# Altium schematic sheet 24 AUDIO CMEDIA.SchDoc
size 594 x 420 mm
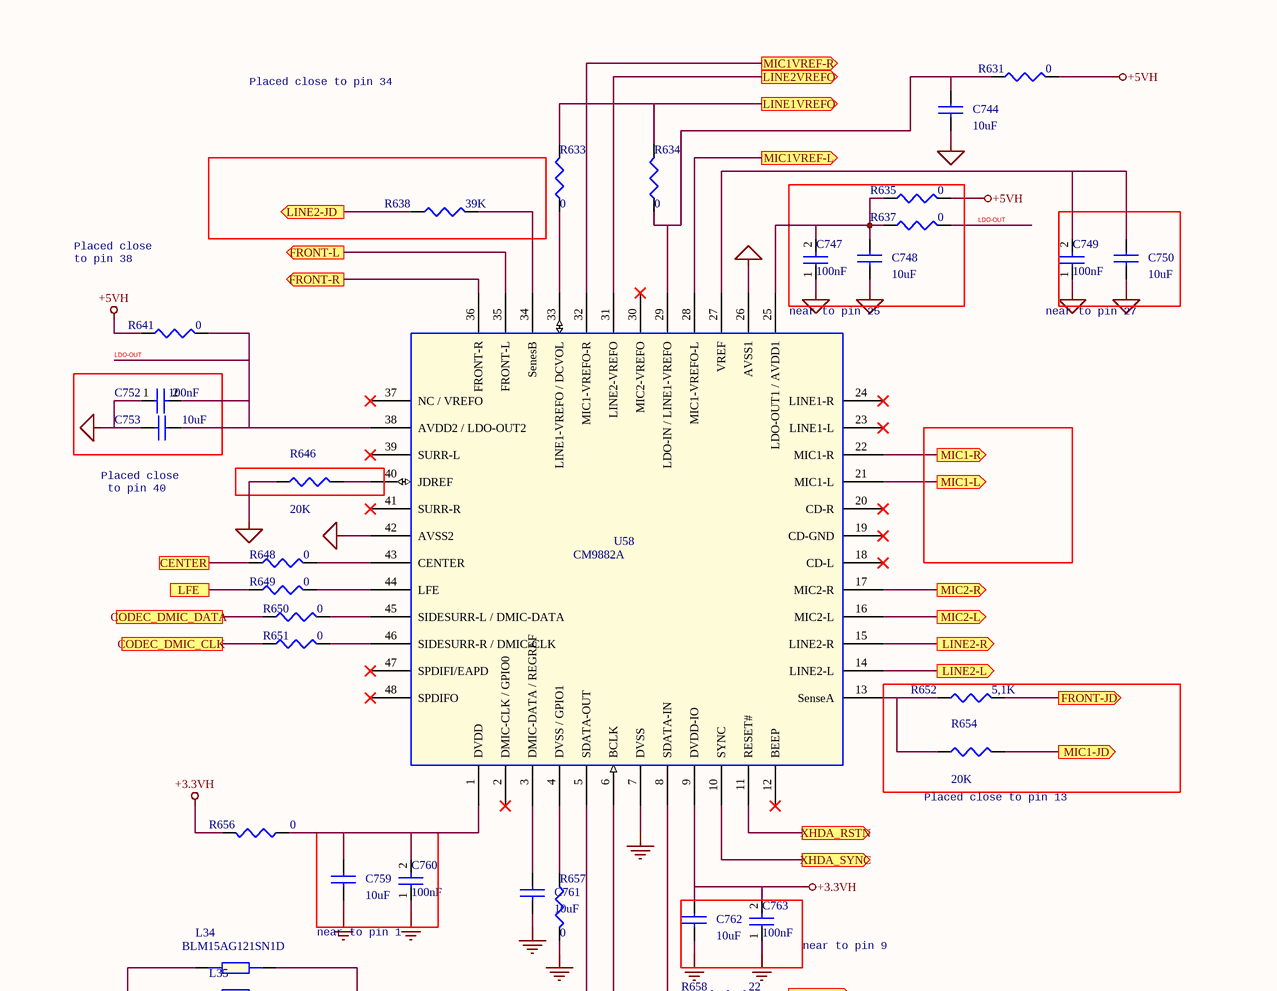
[diagram p0: 24 AUDIO CMEDIA.SchDoc, top left]
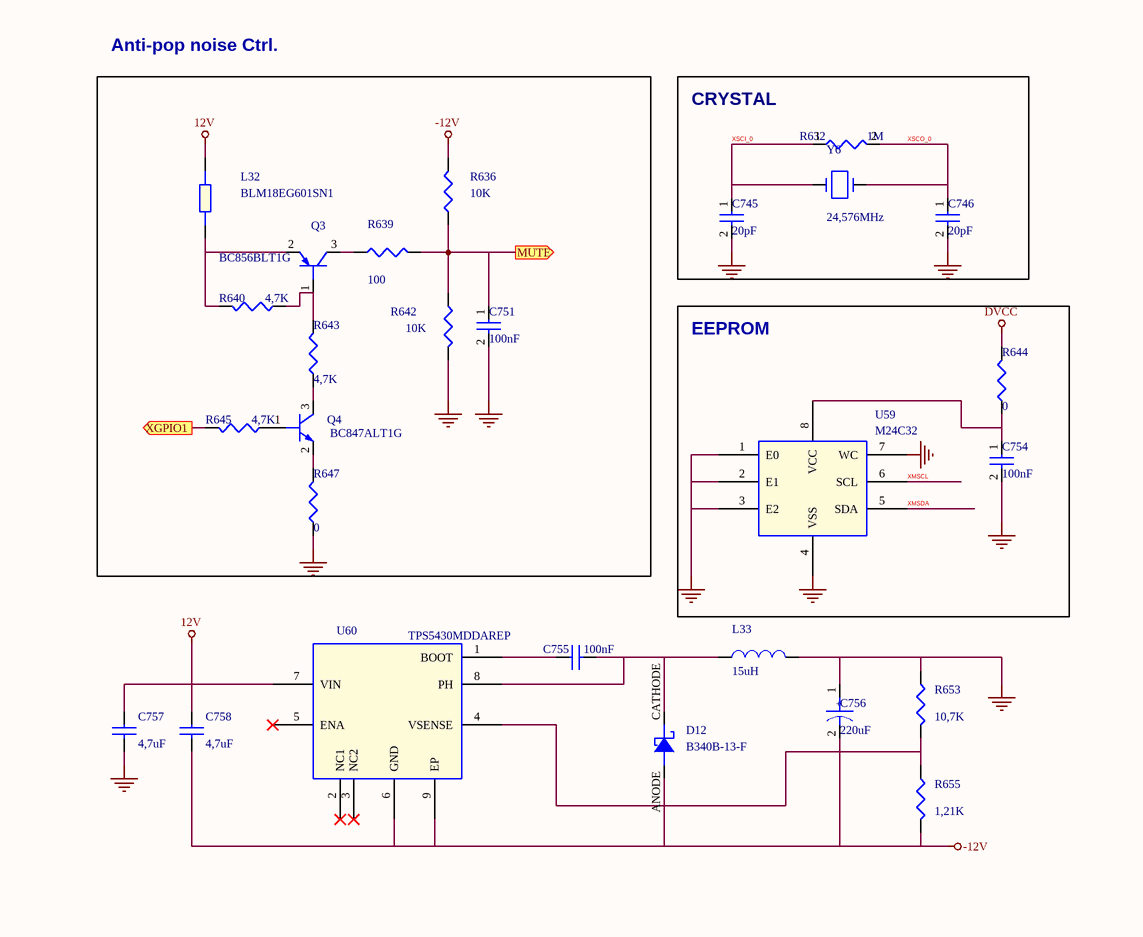
[diagram p1: 24 AUDIO CMEDIA.SchDoc, top right]
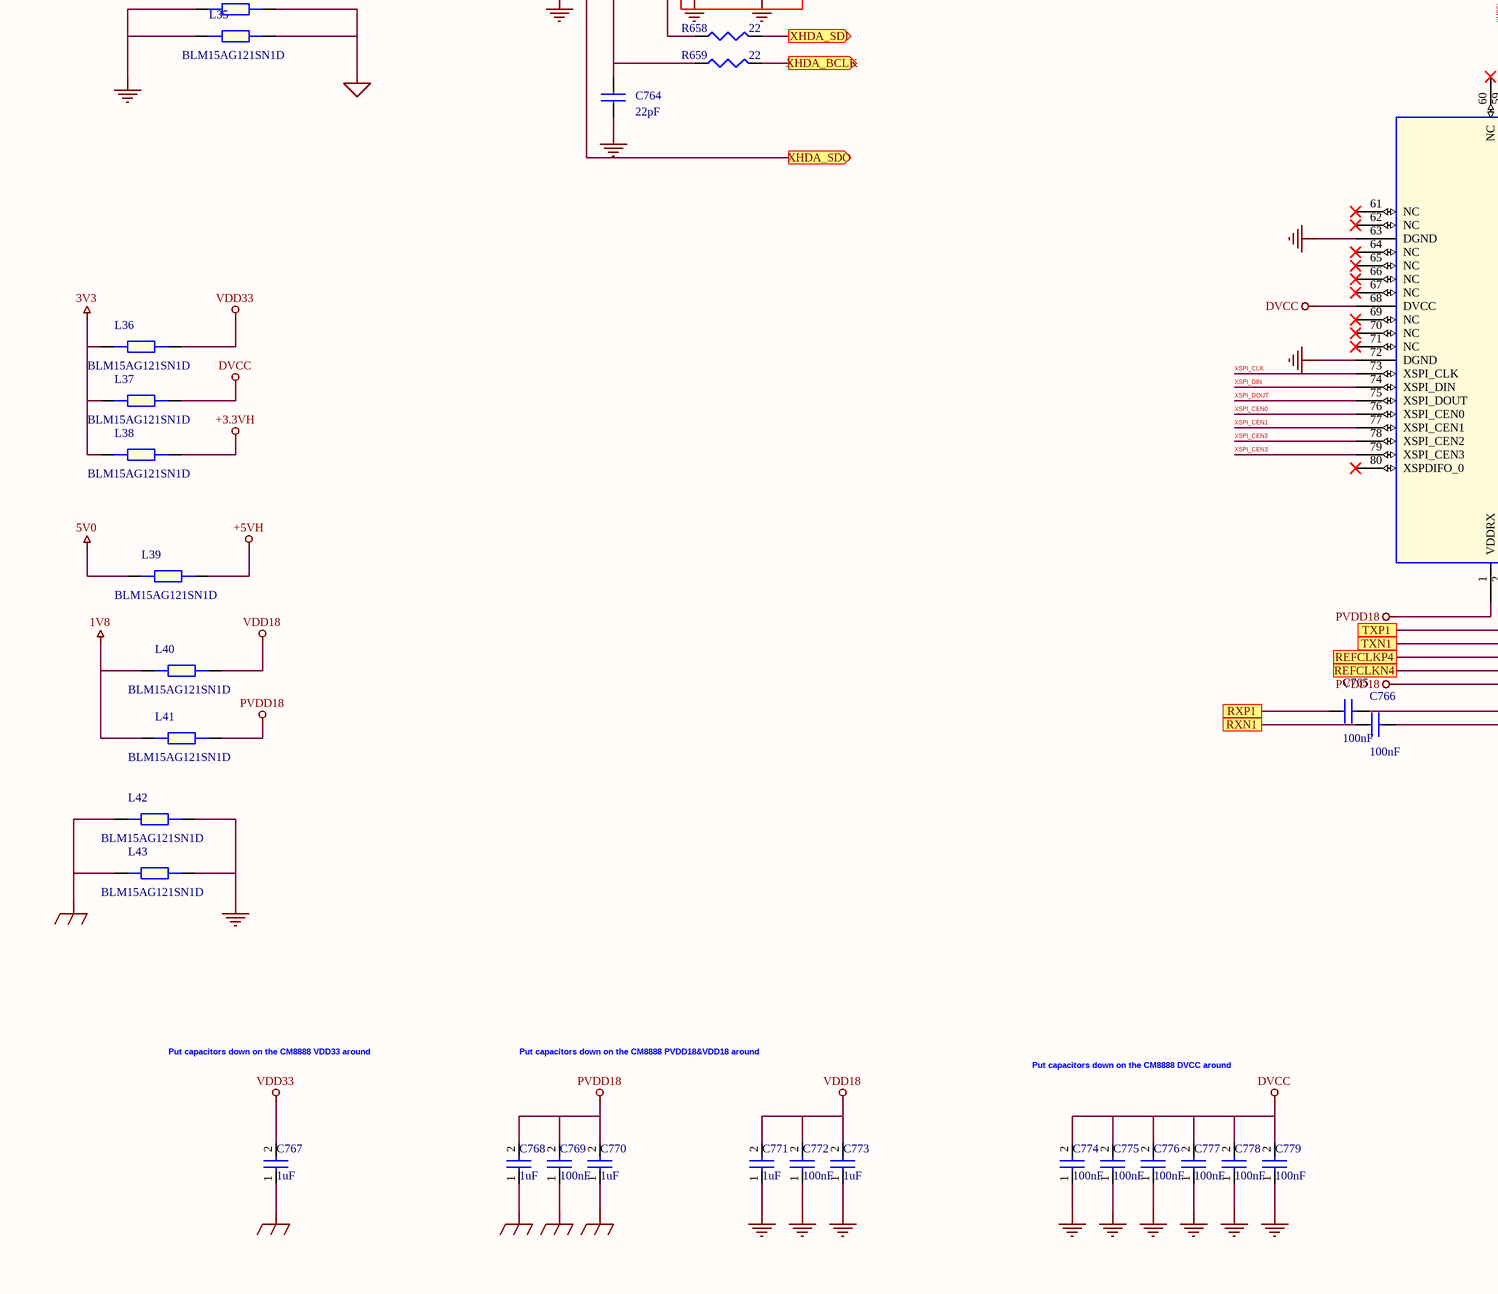
[diagram p2: 24 AUDIO CMEDIA.SchDoc, bottom left]
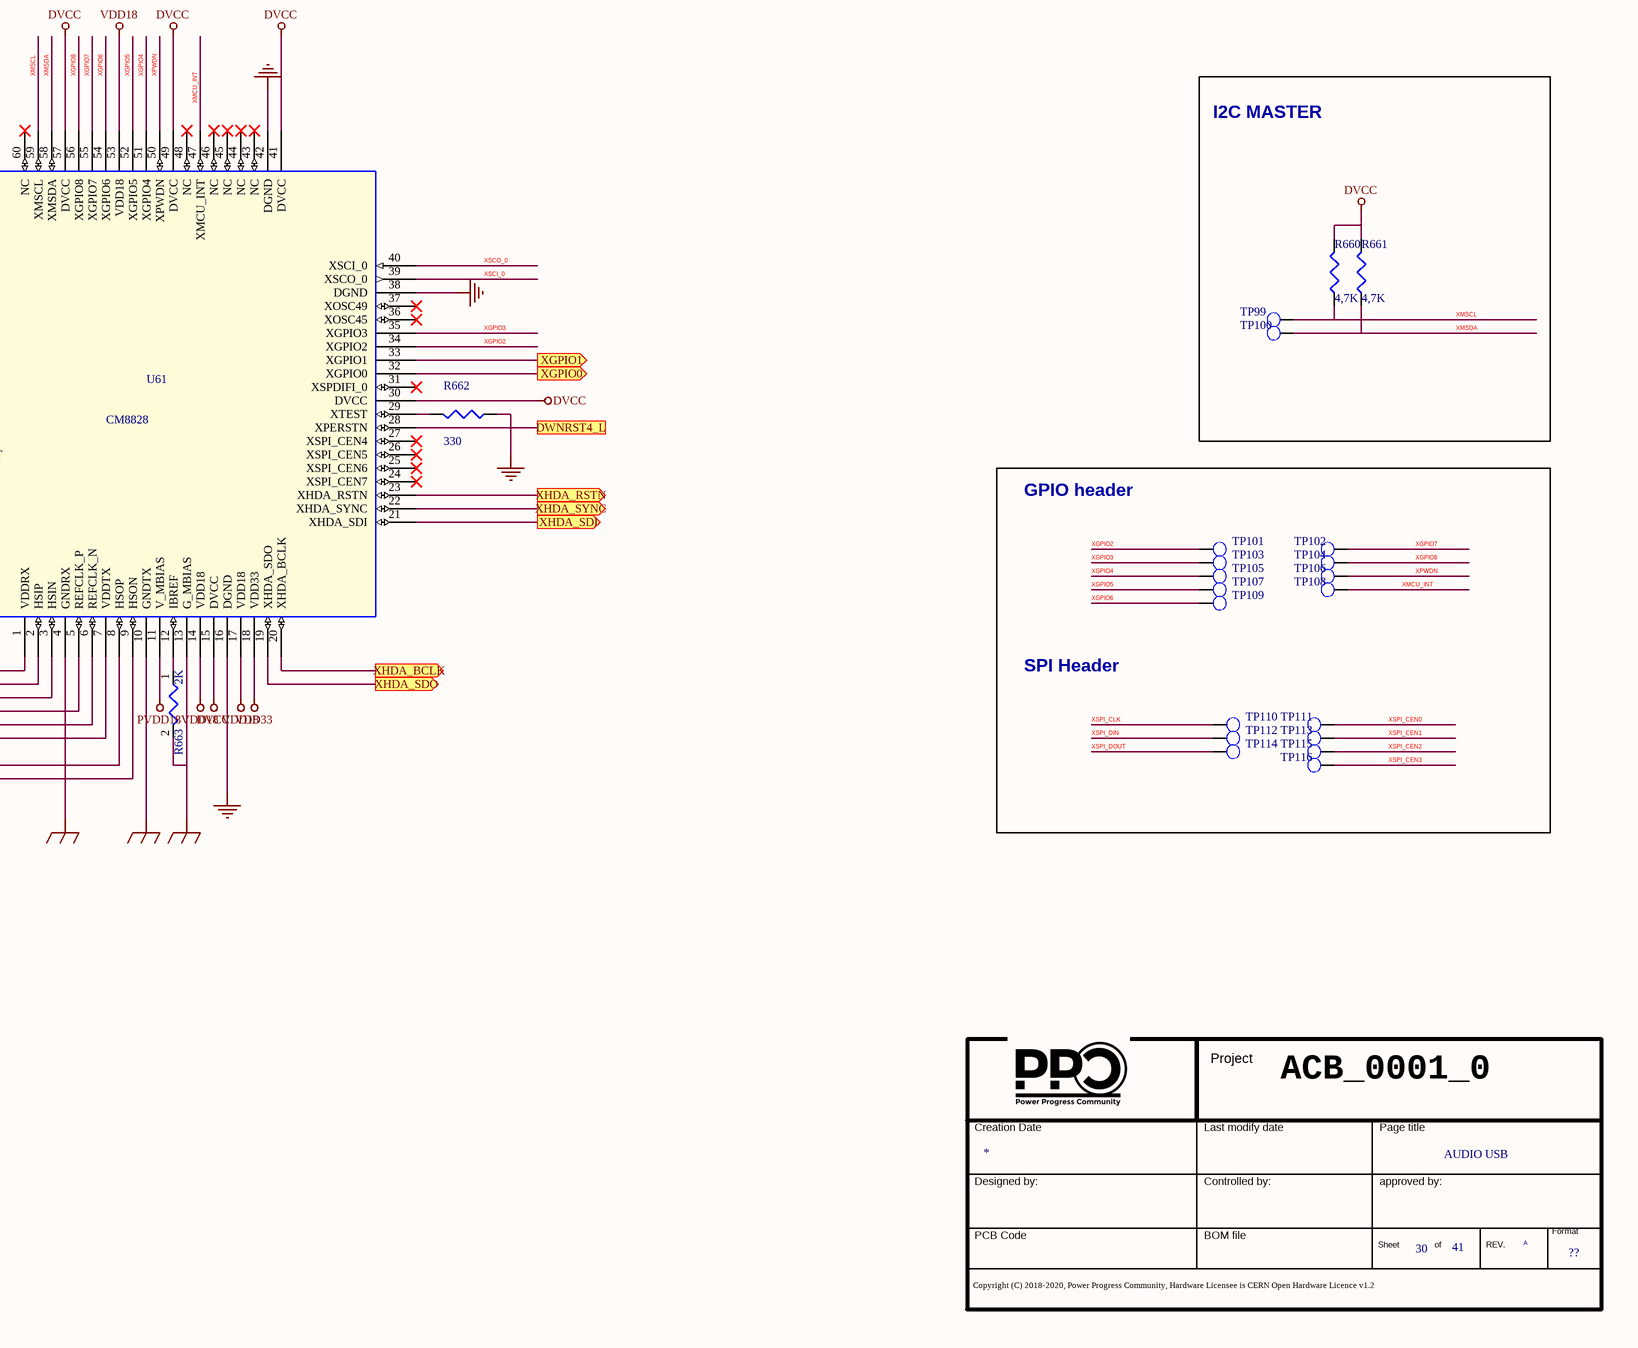
[diagram p3: 24 AUDIO CMEDIA.SchDoc, bottom right]

## Parts
*  Doc: AUDIO USB  Page Count: 41  Page Number: 30  Page Size: ??  RevCode: A  (hidden comment: Title_block_PPC)  (graphical)
C744  10uF  [SMD_0805]
C745  20pF  [SMD_0402]
C746  20pF  [SMD_0402]
C747  100nF  [SMD_0402]
C748  10uF  [SMD_0603]
C749  100nF  [SMD_0402]
C750  10uF  [SMD_0603]
C751  100nF  [SMD_0402]
C752  100nF  [SMD_0402]
C753  10uF  [SMD_0603]
C754  100nF  [SMD_0402]
C755  100nF  [SMD_0402]
C756  220uF  [SMD_CASE_D]
C757  4,7uF  [SMD_0603]
C758  4,7uF  [SMD_0603]
C759  10uF  [SMD_0603]
C760  100nF  [SMD_0402]
C761  10uF  [SMD_0805]
C762  10uF  [SMD_0603]
C763  100nF  [SMD_0402]
C764  22pF  [SMD_0402]
C765  100nF  [SMD_0402]
C766  100nF  [SMD_0402]
C767  1uF  [SMD_0402]
C768  1uF  [SMD_0402]
C769  100nF  [SMD_0402]
C770  1uF  [SMD_0402]
C771  1uF  [SMD_0402]
C772  100nF  [SMD_0402]
C773  1uF  [SMD_0402]
C774  100nF  [SMD_0402]
C775  100nF  [SMD_0402]
C776  100nF  [SMD_0402]
C777  100nF  [SMD_0402]
C778  100nF  [SMD_0402]
C779  100nF  [SMD_0402]
D12  B340B-13-F  [smb]
L32  BLM18EG601SN1  [SMD_0603]
L33  15uH  [SMD]
L34  BLM15AG121SN1D  [SMD_0402]
L35  BLM15AG121SN1D  [SMD_0402]
L36  BLM15AG121SN1D  [SMD_0402]
L37  BLM15AG121SN1D  [SMD_0402]
L38  BLM15AG121SN1D  [SMD_0402]
L39  BLM15AG121SN1D  [SMD_0402]
L40  BLM15AG121SN1D  [SMD_0402]
L41  BLM15AG121SN1D  [SMD_0402]
L42  BLM15AG121SN1D  [SMD_0402]
L43  BLM15AG121SN1D  [SMD_0402]
Q3  BC856BLT1G  [SOT_23]
Q4  BC847ALT1G  [SOT_23]
R631  0  [SMD_0402]
R632  1M  [SMD_0402]
R633  0  [SMD_0402]
R634  0  [SMD_0402]
R635  0  [SMD_0402]
R636  10K  [SMD_0402]
R637  0  [SMD_0402]
R638  39K  [SMD_0402]
R639  100  [SMD_0402]
R640  4,7K  [SMD_0402]
R641  0  [SMD_0402]
R642  10K  [SMD_0402]
R643  4,7K  [SMD_0402]
R644  0  [SMD_0402]
R645  4,7K  [SMD_0402]
R646  20K  [SMD_0402]
R647  0  [SMD_0402]
R648  0  [SMD_0402]
R649  0  [SMD_0402]
R650  0  [SMD_0402]
R651  0  [SMD_0402]
R652  5,1K  [SMD_0402]
R653  10,7K  [SMD_0603]
R654  20K  [SMD_0402]
R655  1,21K  [SMD_0603]
R656  0  [SMD_0402]
R657  0  [SMD_0402]
R658  22  [SMD_0402]
R659  22  [SMD_0402]
R660  4,7K  [SMD_0402]
R661  4,7K  [SMD_0402]
R662  330  [SMD_0402]
R663  2K  [SMD_0402]
TP99  TEST POINT  [PCB]  (value not drawn)
TP100  TEST POINT  [PCB]  (value not drawn)
TP101  TEST POINT  [PCB]  (value not drawn)
TP102  TEST POINT  [PCB]  (value not drawn)
TP103  TEST POINT  [PCB]  (value not drawn)
TP104  TEST POINT  [PCB]  (value not drawn)
TP105  TEST POINT  [PCB]  (value not drawn)
TP106  TEST POINT  [PCB]  (value not drawn)
TP107  TEST POINT  [PCB]  (value not drawn)
TP108  TEST POINT  [PCB]  (value not drawn)
TP109  TEST POINT  [PCB]  (value not drawn)
TP110  TEST POINT  [PCB]  (value not drawn)
TP111  TEST POINT  [PCB]  (value not drawn)
TP112  TEST POINT  [PCB]  (value not drawn)
TP113  TEST POINT  [PCB]  (value not drawn)
TP114  TEST POINT  [PCB]  (value not drawn)
TP115  TEST POINT  [PCB]  (value not drawn)
TP116  TEST POINT  [PCB]  (value not drawn)
U58  CM9882A  [LQFP48]
U59  M24C32  [SOIC8]
U60  TPS5430MDDAREP  [8-SOIC]
U61  CM8828  [LQFP-80]
Y6  24,576MHz  [SMD_HC49/US]

## Blocks framed on the sheet
CRYSTAL: C745 C746 R632 Y6
EEPROM: C754 R644 U59
I2C MASTER: R660 R661 TP99 TP100

## Ports
CENTER, CODEC_DMIC_CLK, CODEC_DMIC_DATA, DWNRST4_L, FRONT-JD (out), FRONT-L (out), FRONT-R (out), LFE, LINE1VREFO (out), LINE2-JD (out), LINE2-L (out), LINE2-R (out), LINE2VREFO (out), MIC1-JD (out), MIC1-L (out), MIC1-R (out), MIC1VREF-L (out), MIC1VREF-R (out), MIC2-L (out), MIC2-R (out), MUTE (out), REFCLKN4, REFCLKP4, RXN1, RXP1, TXN1, TXP1, XGPIO0 (out), XGPIO1 (out), XHDA_BCLK (out), XHDA_RSTN (out), XHDA_SDI (out), XHDA_SDO (out), XHDA_SYNC (out)

## Nets
1V8: L40.1 L41.1
3V3: L36.1 L37.1 L38.1
5V0: L39.1
12V: C757.1 C758.1 L32.1 U60.7(VIN)
+3.3VH: C762.1 C763.2 L38.2 R656.2 U58.9(DVDD-IO)
+5VH: L39.2 R631.1 R635.1 R641.2
-12V: C756.2 C758.2 D12.ANODE R636.2 R655.2 U60.6(GND) U60.9(EP)
AGND: C744.2 C747.1 C748.2 C749.1 C750.2 C752.1 C753.2 L34.2 L35.2 R646.1 U58.26(AVSS1) U58.42(AVSS2)
DGND: C745.2 C746.2 C751.2 C754.2 C759.2 C760.1 C761.2 C762.2 C763.1 C764.1 C771.1 C772.1 C773.1 C774.1 C775.1 C776.1 C777.1 C778.1 C779.1 L34.1 L35.1 L42.2 L43.2 R642.1 R647.1 R657.2 R662.1 U58.7(DVSS) U59.1(E0) U59.2(E1) U59.3(E2) U59.4(VSS) U59.7(WC) U61.16(DGND) U61.38(DGND) U61.42(DGND) U61.63(DGND) U61.72(DGND)
DVCC: C774.2 C775.2 C776.2 C777.2 C778.2 C779.2 L37.2 R644.2 R660.2 R661.2 U61.15(DVCC) U61.30(DVCC) U61.41(DVCC) U61.49(DVCC) U61.57(DVCC) U61.68(DVCC)
GND: C756.1 C757.2 L33.2 R653.1
PHYGND: C767.1 C768.1 C769.1 C770.1 L42.1 L43.1 R663.2 U61.4(GNDRX) U61.10(GNDTX) U61.13(G_MBIAS)
PVDD18: C768.2 C769.2 C770.2 L41.2 U61.1(VDDRX) U61.7(VDDTX) U61.11(V_MBIAS)
VDD18: C771.2 C772.2 C773.2 L40.2 U61.14(VDD18) U61.17(VDD18) U61.53(VDD18)
VDD33: C767.2 L36.2 U61.18(VDD33)
CENTER: R648.1 ; port CENTER
CODEC_DMIC_CLK: R651.1 ; port CODEC_DMIC_CLK
CODEC_DMIC_DATA: R650.1 ; port CODEC_DMIC_DATA
DWNRST4_L: U61.28(XPERSTN) ; port DWNRST4_L
FRONT-JD: R652.1 ; port FRONT-JD
FRONT-L: U58.35(FRONT-L) ; port FRONT-L
FRONT-R: U58.36(FRONT-R) ; port FRONT-R
LDO-OUT: C752.2 C753.1 R637.1 R641.1 U58.38(AVDD2_/_LDO-OUT2)
LFE: R649.1 ; port LFE
LINE1VREFO: R633.1 R634.1 ; port LINE1VREFO
LINE2-JD: R638.2 ; port LINE2-JD
LINE2-L: U58.14(LINE2-L) ; port LINE2-L
LINE2-R: U58.15(LINE2-R) ; port LINE2-R
LINE2VREFO: U58.31(LINE2-VREFO) ; port LINE2VREFO
MIC1-JD: R654.1 ; port MIC1-JD
MIC1-L: U58.21(MIC1-L) ; port MIC1-L
MIC1-R: U58.22(MIC1-R) ; port MIC1-R
MIC1VREF-L: U58.28(MIC1-VREFO-L) ; port MIC1VREF-L
MIC1VREF-R: U58.32(MIC1-VREFO-R) ; port MIC1VREF-R
MIC2-L: U58.16(MIC2-L) ; port MIC2-L
MIC2-R: U58.17(MIC2-R) ; port MIC2-R
MUTE: C751.1 R636.1 R639.2 R642.2 ; port MUTE
REFCLKN4: U61.6(REFCLK_N) ; port REFCLKN4
REFCLKP4: U61.5(REFCLK_P) ; port REFCLKP4
RXN1: C766.1 ; port RXN1
RXP1: C765.1 ; port RXP1
TXN1: U61.3(HSIN) ; port TXN1
TXP1: U61.2(HSIP) ; port TXP1
XGPIO0: U61.32(XGPIO0) ; port XGPIO0
XGPIO1: R645.2 U61.33(XGPIO1) ; port XGPIO1
XGPIO2: TP101.1(TP) U61.34(XGPIO2)
XGPIO3: TP103.1(TP) U61.35(XGPIO3)
XGPIO4: TP105.1(TP) U61.51(XGPIO4)
XGPIO5: TP107.1(TP) U61.52(XGPIO5)
XGPIO6: TP109.1(TP) U61.54(XGPIO6)
XGPIO7: TP102.1(TP) U61.55(XGPIO7)
XGPIO8: TP104.1(TP) U61.56(XGPIO8)
XHDA_BCLK: R659.1 U61.20(XHDA_BCLK) ; port XHDA_BCLK
XHDA_RSTN: U58.11(RESET#) U61.23(XHDA_RSTN) ; port XHDA_RSTN
XHDA_SDI: R658.1 U61.21(XHDA_SDI) ; port XHDA_SDI
XHDA_SDO: U58.5(SDATA-OUT) U61.19(XHDA_SDO) ; port XHDA_SDO
XHDA_SYNC: U58.10(SYNC) U61.22(XHDA_SYNC) ; port XHDA_SYNC
XMCU_INT: TP108.1(TP) U61.47(XMCU_INT)
XMSCL: R660.1 TP99.1(TP) U59.6(SCL) U61.59(XMSCL)
XMSDA: R661.1 TP100.1(TP) U59.5(SDA) U61.58(XMSDA)
XPWDN: TP106.1(TP) U61.50(XPWDN)
XSCI_0: C745.1 R632.1 U61.39(XSCO_0) Y6.1
XSCO_0: C746.1 R632.2 U61.40(XSCI_0) Y6.2
XSPI_CEN0: TP111.1(TP) U61.76(XSPI_CEN0)
XSPI_CEN1: TP113.1(TP) U61.77(XSPI_CEN1)
XSPI_CEN2: TP115.1(TP) U61.78(XSPI_CEN2)
XSPI_CEN3: TP116.1(TP) U61.79(XSPI_CEN3)
XSPI_CLK: TP110.1(TP) U61.73(XSPI_CLK)
XSPI_DIN: TP112.1(TP) U61.74(XSPI_DIN)
XSPI_DOUT: TP114.1(TP) U61.75(XSPI_DOUT)
NetC744_1: C744.1 R631.2 R634.2 U58.29(LDO-IN_/_LINE1-VREFO)
NetC747_2: C747.2 C748.1 R635.2 R637.2 U58.25(LDO-OUT1_/_AVDD1)
NetC749_2: C749.2 C750.1 U58.27(VREF)
NetC754_1: C754.1 R644.1 U59.8(VCC)
NetC755_1: C755.1 U60.1(BOOT)
NetC755_2: C755.2 D12.CATHODE L33.1 U60.8(PH)
NetC759_1: C759.1 C760.2 R656.1 U58.1(DVDD)
NetC761_1: C761.1 U58.3(DMIC-DATA_/_REGREF)
NetC764_2: C764.2 R659.2 U58.6(BCLK)
NetC765_2: C765.2 U61.8(HSOP)
NetC766_2: C766.2 U61.9(HSON)
NetL32_2: L32.2 Q3.2(E) R640.2
NetQ3_1: Q3.1(B) R640.1 R643.2
NetQ3_3: Q3.3(C) R639.1
NetQ4_1: Q4.1(B) R645.1
NetQ4_2: Q4.2(E) R647.2
NetQ4_3: Q4.3(C) R643.1
NetR633_2: R633.2 U58.33(LINE1-VREFO_/_DCVOL)
NetR638_1: R638.1 U58.34(SenesB)
NetR646_2: R646.2 U58.40(JDREF)
NetR648_2: R648.2 U58.43(CENTER)
NetR649_2: R649.2 U58.44(LFE)
NetR650_2: R650.2 U58.45(SIDESURR-L_/_DMIC-DATA)
NetR651_2: R651.2 U58.46(SIDESURR-R_/_DMIC-CLK)
NetR652_2: R652.2 R654.2 U58.13(SenseA)
NetR653_2: R653.2 R655.1 U60.4(VSENSE)
NetR657_1: R657.1 U58.4(DVSS_/_GPIO1)
NetR658_2: R658.2 U58.8(SDATA-IN)
NetR662_2: R662.2 U61.29(XTEST)
NetR663_1: R663.1 U61.12(IBREF)

Not connected (* = marked no-connect by the designer): U58 2(DMIC-CLK_/_GPIO0)* 12(BEEP)* 18(CD-L)* 19(CD-GND)* 20(CD-R)* 23(LINE1-L)* 24(LINE1-R)* 30(MIC2-VREFO)* 37(NC_/_VREFO)* 39(SURR-L)* 41(SURR-R)* 47(SPDIFI/EAPD)* 48(SPDIFO)*; U60 2(NC1)* 3(NC2)* 5(ENA)*; U61 24(XSPI_CEN7)* 25(XSPI_CEN6)* 26(XSPI_CEN5)* 27(XSPI_CEN4)* 31(XSPDIFI_0)* 36(XOSC45)* 37(XOSC49)* 43(NC)* 44(NC)* 45(NC)* 46(NC)* 48(NC)* 60(NC)* 61(NC)* 62(NC)* 64(NC)* 65(NC)* 66(NC)* 67(NC)* 69(NC)* 70(NC)* 71(NC)* 80(XSPDIFO_0)*

## Notes on the sheet
- Placed close to pin 34
- Anti-pop noise Ctrl.
- Placed close
  to pin 38
- (near U58) near to pin 25
- near to pin 27
- (near C753) Placed close
  to pin 40
- (near R654) Placed close to pin 13
- near to pin 1
- (near C763) near to pin 9
- GPIO header
- SPI Header
- Put capacitors down on the CM8888 VDD33 around
- Put capacitors down on the CM8888 PVDD18&VDD18 around
- Put capacitors down on the CM8888 DVCC around
- ACB_0001_0
- (in symbol CAP POL_Dup1) +
- (in symbol Title_block_PPC) Project; Creation Date; Last modify date; Page title; Designed by:; Controlled by:; approved by:; Format; PCB Code; BOM file; Sheet; of; REV.; Copyright (C) 2018-2020, Power Progress Community, Hardware Licensee is CERN Open Hardware Licence v1.2

## Library data of the parts
* = Title_block_PPC: Title: T2080PCIe; Schematic Page Count: 45; Schematic Page Number: 33; Author: MICETEK; Page Create Date: March  8, 1995; Page Title: ?; Page Modify Date: *
C744 C761 = CAP NP_Dup2: COND.CER.10uF 6,3V 10% 0805 X5R SMD; Manufacturer Part Number 1: C0805C106K9PA!A; Manufacturer 1: KEMET; Part Number: PASSIVE_207; RSM: RC0805; PCB Footprint: SMD_0805; Part Type: Capacitors\Ceramic\SMD\0805
C745 C746 = CAP NP_Dup1: COND.CER. 20PF 50V 0402 NP0 SMD; Manufacturer Part Number 1: GRM1555C1H200JZ01D; Manufacturer 1: Murata; Part Number: PASSIVE_58; RSM: RC0402; PCB Footprint: SMD_0402; Part Type: Capacitors\Ceramic\SMD\0402
C747 C749 C751 C760 C763 C769 C772 C774-C779 = CAP NP_Dup1: COND.CER. 100NF 50V 0402 X7R SMD; Manufacturer Part Number 1: CGA2B3X7R1H104M050BD; Manufacturer 1: TDK; Part Number: PASSIVE_24; RSM: RC0402; PCB Footprint: SMD_0402; Part Type: Capacitors\Ceramic\SMD\0402
C748 C750 C753 C759 C762 = CAP NP_Dup2: COND.CER.10uF 0603 25V SMD; Manufacturer Part Number 1: CL10A106MA8NRNC; Manufacturer 1: SAMSUNG; Part Number: PASSIVE_124; RSM: RC0603; PCB Footprint: SMD_0603; Part Type: Capacitors\Ceramic\SMD\0603
C752 C754 = CAP NP_Dup1: COND.CER. 100NF 50V 0402 X7R SMD; Part Number: PASSIVE_24; Manufacturer 1: TDK; Manufacturer Part Number 1: CGA2B3X7R1H104M050BD; RSM: RC0402; Part Type: Capacitors\Ceramic\SMD\0402; PCB Footprint: SMD_0402
C755 = CAP NP_Dup2: COND.CER. 100NF 50V 0402 X7R SMD; Manufacturer Part Number 1: CGA2B3X7R1H104M050BD; Manufacturer 1: TDK; Part Number: PASSIVE_24; RSM: RC0402; PCB Footprint: SMD_0402; Distributor 1: DIGKEY (445-9694-2-ND); Part Type: Capacitors\Ceramic\SMD\0402
C756 = CAP POL_Dup1: CAP TANT 220UF 16V 10% 2917; Part Number: PASSIVE_339; Manufacturer 1: KEMET; Manufacturer Part Number 1: T491D227K016ZT; RSM: TANT-D; Part Type: Capacitors\Tantalum\SMD\CASE_D; PCB Footprint: SMD_CASE_D
C757 C758 = CAP NP_Dup2: COND.CER.4,7uF 16V X5R 0603 SMD; Manufacturer Part Number 1: CL10A475KO8NNNC; Manufacturer 1: SAMSUNG; Part Number: PASSIVE_1405; RSM: RC0603; Distributor 1: DIGIKEY (445-5980-1-ND); Part Type: Capacitors\Ceramic\SMD\0603; PCB Footprint: SMD_0603
C764 = CAP NP_Dup2: COND.CER. 22PF 50V 0402 NPO 5% SMD; Part Number: PASSIVE_65; Manufacturer 1: Murata; Manufacturer Part Number 1: GRM1555C1H220JZ01; RSM: RC0402; Part Type: Capacitors\Ceramic\SMD\0402; PCB Footprint: SMD_0402
C765 C766 = CAP NP_Dup2: COND.CER. 100NF 50V 0402 X7R SMD; Part Number: PASSIVE_24; Manufacturer 1: TDK; Manufacturer Part Number 1: CGA2B3X7R1H104M050BD; RSM: RC0402; Part Type: Capacitors\Ceramic\SMD\0402; PCB Footprint: SMD_0402
C767 C768 C770 C771 C773 = CAP NP_Dup1: CAP CER 1UF 10V 10% X5R 0402; Manufacturer Part Number 1: GRM155R61A105KE15D; Manufacturer 1: Murata; Part Number: PASSIVE_50; RSM: RC0402; PCB Footprint: SMD_0402; Part Type: Capacitors\Ceramic\SMD\0402
D12 = diode_schottky: DIODE SCHOTTKY 40V 3A SMB; Manufacturer 1: DIODES; Part Number: DISCRETE_78; RSM: SMB-AK; PCB Footprint: smb; Distributor 1: DIGIKEY(B340B-FDIDKR-ND); Manufacturer Part Number 1: B340B-13-F; Part Type: Diodes\SCHOTTKY
L32 = FERRITE_BEAD: FERRITE BEAD 600ohm 500mA 0603 SMD; Part Number: PASSIVE_377; Manufacturer 1: Murata; Manufacturer Part Number 1: BLM18EG601SN1 SMD; RSM: RC0603; Part Type: Ferrite Beads\SMD\0603; PCB Footprint: SMD_0603
L33 = INDUCTOR_Dup1: INDUCTOR POWER .68UH 17A SMD 6.90mm x 6.90mm; Part Number: PASSIVE_434; Manufacturer 1: WURTH; Manufacturer Part Number 1: 744311068; RSM: IND-WE-744311068; Part Type: Inductors\SMD; Distributor 1: DIGIKEY(732-1149-1-ND); PCB Footprint: SMD
L34-L38 = FERRITE_BEAD: FERRITE CHIP 120 OHM 500MA 0402; Part Number: PASSIVE_370; Manufacturer 1: Murata; RSM: RC0402; Part Type: Ferrite Beads\SMD\0402; Manufacturer Part Number 1: BLM15AG121SN1D; Distributor 1: DIGIKEY (490-1005-2-ND); PCB Footprint: SMD_0402
L39-L43 = FERRITE_BEAD: FERRITE CHIP 120 OHM 500MA 0402; Manufacturer 1: Murata; Part Number: PASSIVE_370; RSM: RC0402; PCB Footprint: SMD_0402; Distributor 1: DIGIKEY (490-1005-2-ND); Manufacturer Part Number 1: BLM15AG121SN1D; Part Type: Ferrite Beads\SMD\0402
Q3 = PNP BEC: TRANS PNP 65V 0.1A SOT23; Part Number: DISCRETE_260; Manufacturer 1: ON SEMICONDUCTOR; RSM: SOT-23; Part Type: Transistors\Bipolar\PNP; Manufacturer Part Number 1: BC856BLT1G; Distributor 1: DIGIKEY(BC856BLT1GOSCT-ND); PCB Footprint: SOT_23
Q4 = NPN BEC: TRANS NPN 45V 0.1A SOT23; Part Number: DISCRETE_258; Manufacturer 1: ON Semi; RSM: SOT-23; Part Type: Transistors\Bipolar\NPN; Manufacturer Part Number 1: BC847ALT1G; Distributor 1: DIGIKEY (BC847ALT1GOSCT-ND); PCB Footprint: SOT_23
R631 R633 R637 R644 = R_Dup2: RESIS.CHIP 0R 5% 0402 SMD; Manufacturer 1: ROYAL OHM; Part Number: PASSIVE_805; RSM: RC0402; Manufacturer Part Number 1: RESIS.CHIP 0R 5% 0402 SMD; Part Type: Resistors\Fixed\SMD\0402\5%; PCB Footprint: SMD_0402
R632 = R_Dup3: RESIS.CHIP 1M 1% 0402 SMD; Manufacturer Part Number 1: RESIS.1M 1% 0402 SMD; Manufacturer 1: ROYAL OHM; Part Number: PASSIVE_630; RSM: RC0402; PCB Footprint: SMD_0402; Part Type: Resistors\Fixed\SMD\0402\1%
R634 R635 R641 R647 R656 R657 = R_Dup2: RESIS.CHIP 0R 5% 0402 SMD; Part Number: PASSIVE_805; Manufacturer 1: ROYAL OHM; RSM: RC0402; Part Type: Resistors\Fixed\SMD\0402\5%; PCB Footprint: SMD_0402; Manufacturer Part Number 1: RESIS.CHIP 0R 5% 0402 SMD
R636 = R_Dup5: RESIS.CHIP 10K 1% 0402 SMD; Manufacturer 1: ROYAL OHM; Part Number: PASSIVE_584; RSM: RC0402; Manufacturer Part Number 1: RESIS.CHIP 10K 1% 0402 SMD; PCB Footprint: SMD_0402; Part Type: Resistors\Fixed\SMD\0402\1%
R638 = R_Dup2: RESIS.CHIP 39K 1% 0402 SMD; Part Number: PASSIVE_714; Manufacturer 1: bourns; Manufacturer Part Number 1: CR0402-FX-3902GLF; RSM: RC0402; Part Type: Resistors\Fixed\SMD\0402\1%; PCB Footprint: SMD_0402
R639 = R_Dup5: RESIS.CHIP 100R 5% 0402 SMD; Manufacturer 1: ROYAL OHM; Part Number: PASSIVE_812; RSM: RC0402; Manufacturer Part Number 1: RESIS.CHIP 100R 5% 0402 SMD; PCB Footprint: SMD_0402; Part Type: Resistors\Fixed\SMD\0402\5%
R640 R643 R645 R660 R661 = R_Dup2: RES 4.7K OHM 1/10W 1% 0402 SMD; Part Number: PASSIVE_718; Manufacturer 1: PANASONIC; Manufacturer Part Number 1: ERJ-2RKF4701X; RSM: RC0402; Part Type: Resistors\Fixed\SMD\0402\1%; PCB Footprint: SMD_0402
R642 = R_Dup5: RESIS.CHIP 10K 1% 0402 SMD; Part Number: PASSIVE_584; Manufacturer 1: ROYAL OHM; RSM: RC0402; Part Type: Resistors\Fixed\SMD\0402\1%; Manufacturer Part Number 1: RESIS.CHIP 10K 1% 0402 SMD; PCB Footprint: SMD_0402
R646 R654 = R_Dup5: RESIS.CHIP 20K 1% 0402 SMD; Manufacturer Part Number 1: RC0402FR-1320KL; Manufacturer 1: YAGEO; Part Number: PASSIVE_641; RSM: RC0402; PCB Footprint: SMD_0402; Part Type: Resistors\Fixed\SMD\0402\1%
R648 R649 = R_Dup5: RESIS.CHIP 0R 5% 0402 SMD; Manufacturer 1: ROYAL OHM; Part Number: PASSIVE_805; RSM: RC0402; PCB Footprint: SMD_0402; Distributor 1: CAMEL ELETTRONICA SRL  #; Manufacturer Part Number 1: RESIS.CHIP 0R 5% 0402 SMD; Part Type: Resistors\Fixed\SMD\0402\5%
R650 R651 = R_Dup5: RESIS.CHIP 0R 5% 0402 SMD; Part Number: PASSIVE_805; Manufacturer 1: ROYAL OHM; RSM: RC0402; Part Type: Resistors\Fixed\SMD\0402\5%; Manufacturer Part Number 1: RESIS.CHIP 0R 5% 0402 SMD; Distributor 1: CAMEL ELETTRONICA SRL  #; PCB Footprint: SMD_0402
R652 = R_Dup2: RES SMD 5.1K OHM 1% 1/16W 0402; Part Number: PASSIVE_742; Manufacturer 1: YAGEO; Manufacturer Part Number 1: RC0402FR-075K1L; RSM: RC0402; Part Type: Resistors\Fixed\SMD\0402\1%; PCB Footprint: SMD_0402
R653 = R_Dup5: RESIS.CHIP 10,7K 1% 0603 E96; Manufacturer 1: ROYAL OHM; Part Number: PASSIVE_897; RSM: RC0603; PCB Footprint: SMD_0603; Distributor 1: CAMEL ELETTRONICA SRL  #; Manufacturer Part Number 1: RESIS.CHIP 10,7K 1% 0603 E96; Part Type: Resistors\Fixed\SMD\0603\1%
R655 = R_Dup5: RESIS.CHIP 1,21K 1% 0603 SMD; Part Number: PASSIVE_884; Manufacturer 1: ROYAL OHM; Manufacturer Part Number 1: RES.1K21 1% 0603 SMD; RSM: RC0603; PCB Footprint: SMD_0603; Part Type: Resistors\Fixed\SMD\0603\1%; Distributor 1: CAMEL ELETTRONICA SRL  #
R658 R659 = R_Dup2: RESIS.CHIP 22R 5% 0402 SMD; Manufacturer 1: ROYAL OHM; Part Number: PASSIVE_840; RSM: RC0402; Manufacturer Part Number 1: RESIS.CHIP 22R 5% 0402 SMD; PCB Footprint: SMD_0402; Part Type: Resistors\Fixed\SMD\0402\5%
R662 = R_Dup5: RESIS.CHIP 330R 5% 0402 SMD; Part Number: PASSIVE_854; Manufacturer 1: ROYAL OHM; RSM: RC0402; Part Type: Resistors\Fixed\SMD\0402\5%; PCB Footprint: SMD_0402; Manufacturer Part Number 1: RESIS.CHIP 330R 5% 0402 SMD
R663 = R_Dup1: RESIS.CHIP 2K 1% 0402 SMD; Manufacturer 1: ROYAL OHM; Part Number: PASSIVE_669; RSM: RC0402; Manufacturer Part Number 1: RESIS.CHIP 2K 1% 0402 SMD; PCB Footprint: SMD_0402; Part Type: Resistors\Fixed\SMD\0402\1%
TP99-TP116 = T POINT R: TEST POINT SU PCB; Part Number: CONNECTORS_542; RSM: AE-TESTPOINT; PCB Footprint: PCB; Part Type: Tpoint
U58 = CMI120_50: CODEC AUDIO CM9882A; Manufacturer 1: CMEDIA; Part Number: LOGIC_358; RSM: LQFP-48; Distributor 1: CMEDIA; Manufacturer Part Number 1: CM9882A; PCB Footprint: LQFP48; Part Type: CODEC\I2S
U59 = M24C32: EEPROM EEPROM S I2C 32k; Manufacturer Part Number 1: M24C32-WMN6TP; Manufacturer 1: ST; Part Number: MEMORIES_7; RSM: SO-8; Distributor 1: MOUSER(511-M24C32-WMN6TP); Part Type: EEPROM; PCB Footprint: SOIC8
U60 = TPS5430: IC REG BUCK ADJ 3A 8SOPWRPAD HiRel; Part Number: LINEAR_229; Manufacturer 1: TEXAS; RSM: SO-8-EXPOSED-PAD; PCB Footprint: 8-SOIC; Part Type: Regulators\Switching; Manufacturer Part Number 1: TPS5430MDDAREP; Distributor 1: DIGIKEY (ey	296-24266-1-ND)
U61 = RM5011_16: High Performance PCI Express Audio Processor; 1ST PART FIELD: CMI8788/ CMI8787; Part Number: LOGIC_357; Manufacturer 1: CMEDIA; RSM: LQFP-80-0_4; Part Type: PCIE\PCIE_AUDIO; Manufacturer Part Number 1: CM8828; Distributor 1: CMEDIA; PCB Footprint: LQFP-80
Y6 = CRYSTAL: QUARZO 24,576MHz HC49/USM4 CL16 FUNZ.SMD; Manufacturer Part Number 1: HC49/USM4-024M5760000UR (ROHS COMPLIANT); Manufacturer 1: MEGATEC (Cod.Forn:QSXTM24576UG55LSF); Part Number: MISC_121; RSM: XC-HC49S; Distributor 1: MODULI ELETTRONICI E COMPONENTI spa; Part Type: Quartz; PCB Footprint: SMD_HC49/US